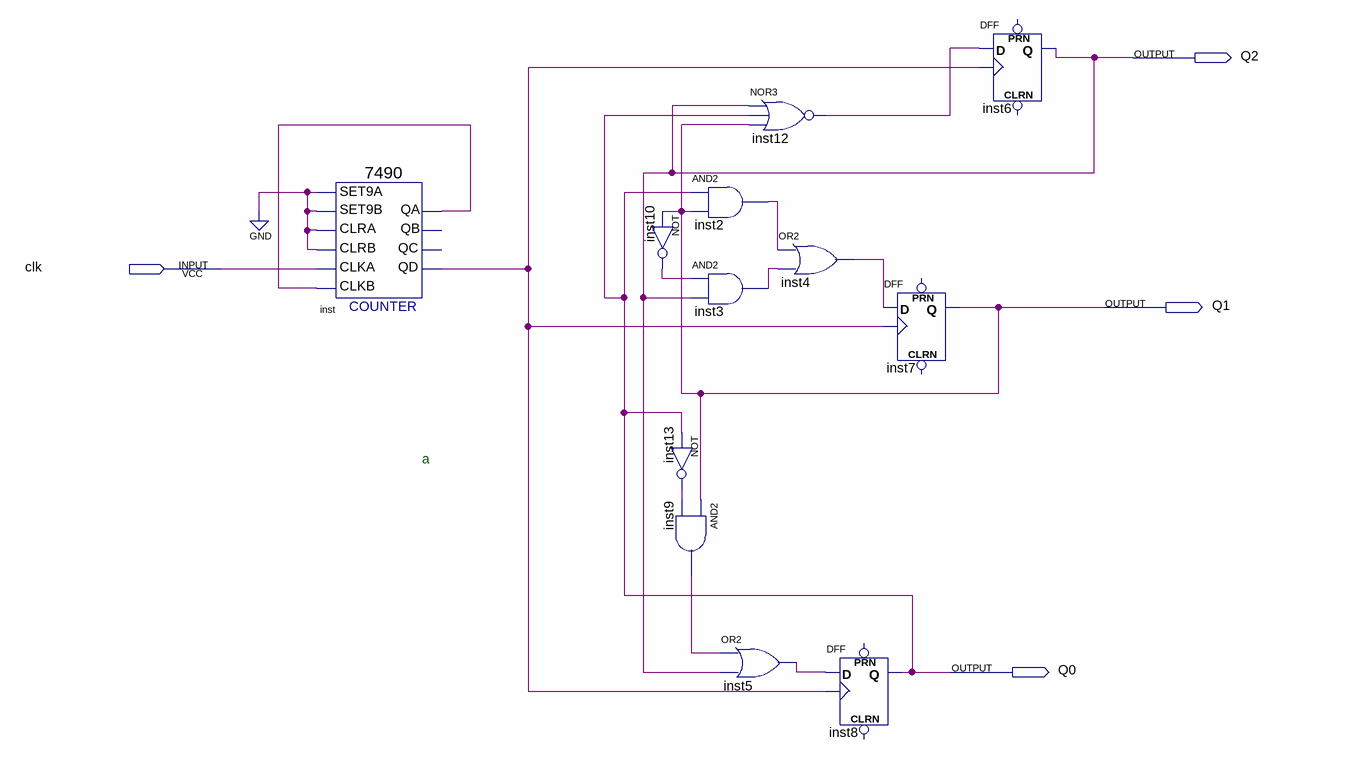
[diagram p0: schematic sheet]
// Quartus schematic HW08.bdf as structural Verilog: 12 symbols, 4 pins
module HW08 (
  input  clk,
  output Q2,
  output Q1,
  output Q0
);

  wire inst2_out, inst3_out, inst4_out, inst5_out, inst9_out, inst10_out, inst12_out, inst13_out, inst_qa,
       inst_qd;

  \7490  inst (
    .SET9A(1'b0), .CLRA(1'b0), .SET9B(1'b0), .CLKB(inst_qa), .CLKA(clk), .CLRB(1'b0), .QD(inst_qd),
    .QA(inst_qa));  // open: QB, QC
  not inst10 (inst10_out, Q1);
  not inst13 (inst13_out, Q0);
  and inst9 (inst9_out, Q1, inst13_out);
  nor inst12 (inst12_out, Q2, Q0, Q1);
  and inst2 (inst2_out, Q0, Q1);
  and inst3 (inst3_out, inst10_out, Q2);
  or inst5 (inst5_out, inst9_out, Q2);
  or inst4 (inst4_out, inst2_out, inst3_out);
  DFF inst8 (.CLK(inst_qd), .D(inst5_out), .Q(Q0));  // open: CLRN, PRN
  DFF inst7 (.CLK(inst_qd), .D(inst4_out), .Q(Q1));  // open: CLRN, PRN
  DFF inst6 (.CLK(inst_qd), .D(inst12_out), .Q(Q2));  // open: CLRN, PRN

  // Notes on the sheet:
  //   a
endmodule
